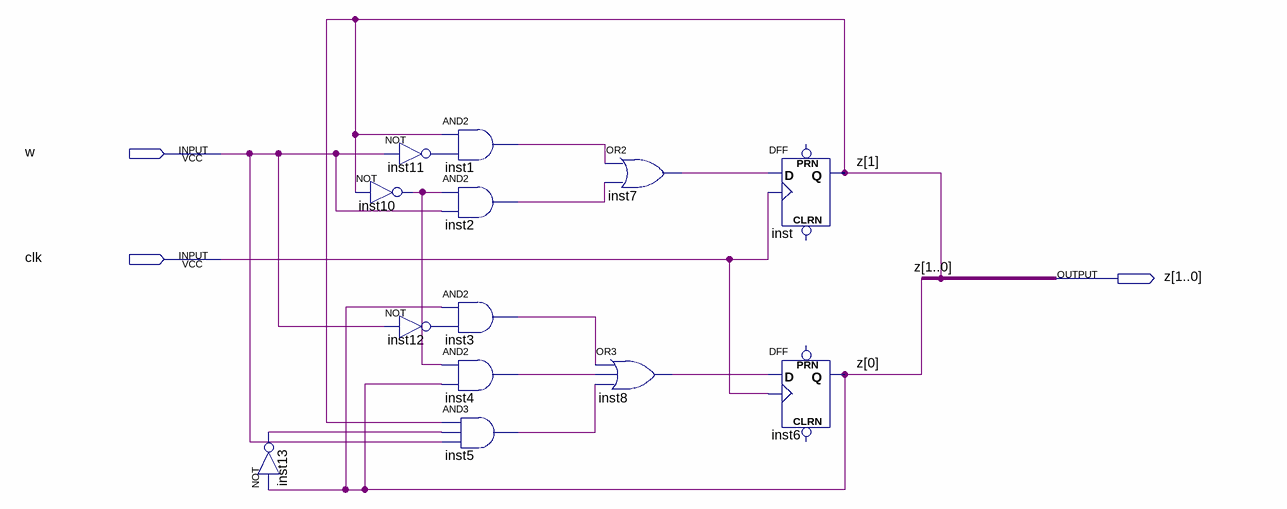
[diagram p0: schematic sheet]
// Quartus schematic testCounter.bdf as structural Verilog: 13 symbols, 3 pins
module testCounter (
  input  w,
  input  clk,
  output [1:0] z
);

  wire inst1_out, inst2_out, inst3_out, inst4_out, inst5_out, inst7_out, inst8_out, inst10_out, inst11_out,
       inst12_out, inst13_out;

  not inst13 (inst13_out, z[0]);
  not inst11 (inst11_out, w);
  not inst10 (inst10_out, z[1]);
  not inst12 (inst12_out, w);
  and inst1 (inst1_out, z[1], inst11_out);
  and inst2 (inst2_out, inst10_out, w);
  and inst3 (inst3_out, z[0], inst12_out);
  and inst4 (inst4_out, inst10_out, z[0]);
  and inst5 (inst5_out, z[1], inst13_out, w);
  or inst7 (inst7_out, inst1_out, inst2_out);
  or inst8 (inst8_out, inst3_out, inst4_out, inst5_out);
  DFF inst (.CLK(clk), .D(inst7_out), .Q(z[1]));  // open: CLRN, PRN
  DFF inst6 (.CLK(clk), .D(inst8_out), .Q(z[0]));  // open: CLRN, PRN
endmodule
